# Altium project HV_DCDC.PrjPcb
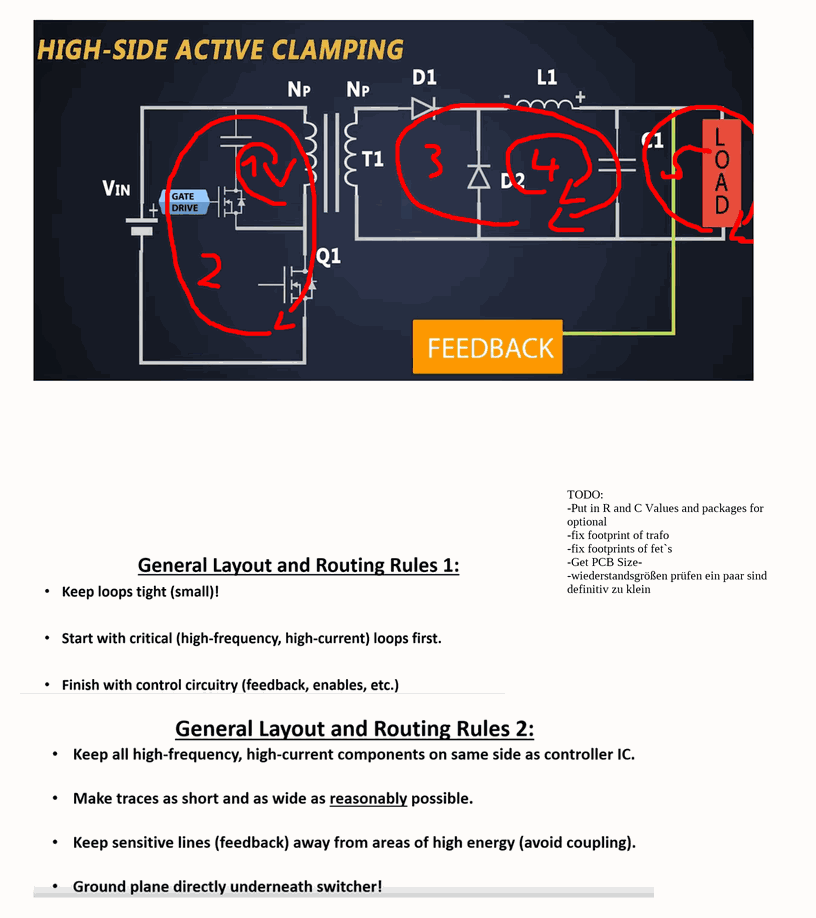
[diagram p0: Info.SchDoc]
7 sheets, 114 parts. Net scope: global (net labels, ports and power ports of the same name join across sheets).
Board files: HV_DCDC_V2.PcbDoc, HV_DCDC.PcbDoc
Sheets:
  Info.SchDoc
  In.SchDoc
  Prim_CTRL.SchDoc
  Sek_CTRL.SchDoc
  V_AUX.SchDoc
  Trafo.SchDoc
  Out.SchDoc

## Sheet Info.SchDoc
size A4; SheetNumber: 1; SheetTotal: 8

### Notes on the sheet
- TODO:
  -Put in R and C Values and packages for optional
  -fix footprint of trafo
  -fix footprints of fet`s
  -Get PCB Size-
  -wiederstandsgrößen prüfen ein paar sind definitiv zu klein

## Sheet In.SchDoc
size A4; SheetNumber: 2; SheetTotal: 8
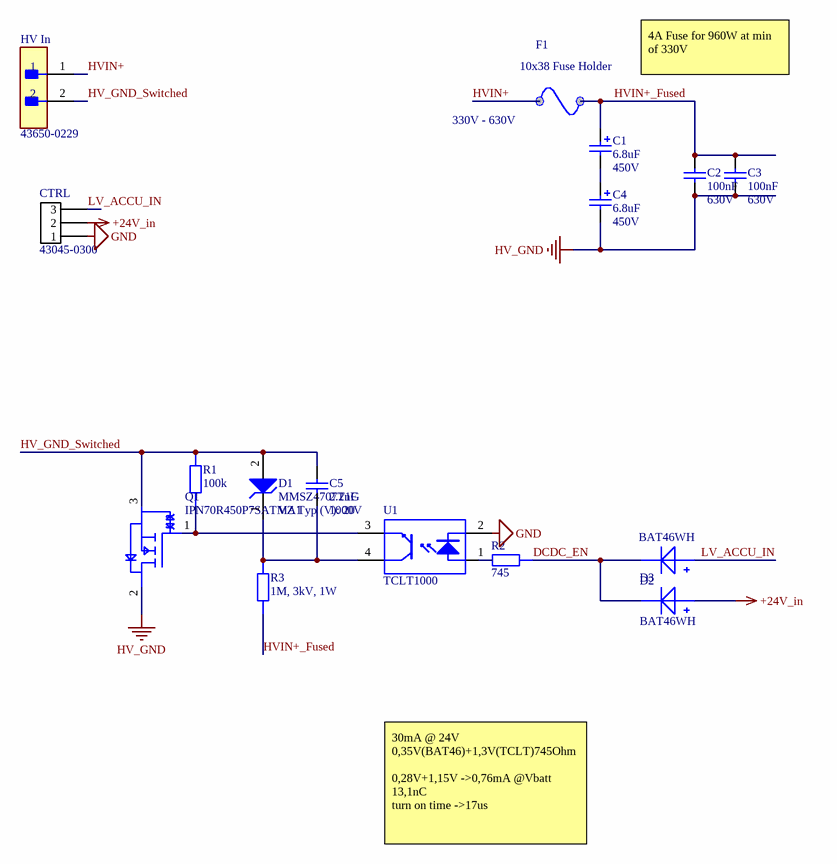
[diagram p1: In.SchDoc]

### Parts
C1  6.8uF  Voltage: 450V  [WCAP-AT1H_D13H20]
C2  Capacitance: 100nF  Voltage: 630V  [WCAP-CSMH_1812_H2]
C3  Capacitance: 100nF  Voltage: 630V  [WCAP-CSMH_1812_H2]
C4  6.8uF  Voltage: 450V  [WCAP-AT1H_D13H20]
C5  Capacitance: 2.2nF  Voltage: 1000V  [WCAP-CSMH_0805_H1.25]
CTRL  43045-0300  [43650-0315]
D1  MMSZ4707T1G  VZ Typ (V): 20  [ONSC-SOD-123-2-425-04_V]
D2  BAT46WH  [DIOM2715X18N]
D3  BAT46WH  [DIOM2715X18N]
F1  10x38 Fuse Holder  [10x38 Fuse]
HV_In  43650-0229  [FP-43650-0229-MFG]
Q1  IPN70R450P7SATMA1  [SOT230P700X180-4L]
R1  value 100k  [STACKPOLE CSR0603]  (hidden comment: SMD Resistor)
R2  value 745  [STACKPOLE CSR0603]  (hidden comment: SMD Resistor)
R3  value 1M, 3kV, 1W  [STACKPOLE CSRN2512]  (hidden comment: CHV2512-FX-1004ELF)
U1  TCLT1000  [VISH-SOP4L-4_V]

### Nets
+24V_in: CTRL.2 D3.1
GND: CTRL.1 U1.2(C)
HV_GND: C2.2 C3.2 C4.2(N) Q1.2
DCDC_EN: D2.2 D3.2 R2.2
HV_GND_Switched: C5.2 D1.2(A) HV_In.2 Q1.3 R1.1
HVIN+: F1.2 HV_In.1
HVIN+_Fused: C1.1(P) C2.1 C3.1 F1.1 R3.2
LV_ACCU_IN: CTRL.3 D2.1
NetC1_2: C1.2(N) C4.1(P)
NetC5_1: C5.1 D1.1(K) R3.1 U1.4(C)
NetQ1_1: Q1.1 R1.2 U1.3(E)
NetR2_1: R2.1 U1.1(A)

### Notes on the sheet
- (near F1) 330V - 630V
- 4A Fuse for 960W at min of 330V
- 30mA @ 24V
  0,35V(BAT46)+1,3V(TCLT)745Ohm
  0,28V+1,15V ->0,76mA @Vbatt
  13,1nC
  turn on time ->17us
- Title:
- Projekt:
- Revision:
- Author:
- Rules:
- Checked by:
- Sheet
- of
- Size:
- A4
- Date:
- Time:

### Library data of the parts
C1 C4 = 860241478002: WCAP-AT1H Aluminum Electrolytic Capacitor, Radial, THT, D13xH20mm, 6.8uF, 450V; Manufacturer: Wurth Elektronik; Rated Voltage: 450VDC; Technical Reference: ATJI2006R8M450DSPACK000; Ripple Current: 240mA; Capacitance Tolerance: +/-20%; Leakage Current: 222.4uA; Endurance: 10000h; Dissipation Factor: 20%; Published Date: October 2020; Operating Temperature: -25 to +105degC; Capacitance: 6.8uF; Packaging: Ammo Pack; Mounting Technology: THT; Manufacturer Part Number: 860241478002; Height: 20mm; Diameter: 13mm; ComponentLink2URL: https://www.we-online.com/catalog/datasheet/860241478002.pdf; ComponentLink2Description: Datasheet; ComponentLink1URL: http://www.we-online.de; ComponentLink1Description: Manufacturer
C2 C3 = 885342211006: WCAP-CSMH Multilayer Ceramic Chip Capacitor, size 1812, X7R Class II, 100nF, 630V; Manufacturer: Wurth Elektronik; Rated Voltage: 630VDC; Insulation Resistance: 1GOhm; Dissipation Factor: 2.5%; Capacitance Tolerance: +/-10%; Technical Reference: X7R1812104K630DFCT10000; ComponentLink1Description: Manufacturer; ComponentLink1URL: http://www.we-online.de; ComponentLink2Description: Datasheet; ComponentLink2URL: https://www.we-online.com/catalog/datasheet/885342211006.pdf; Manufacturer Part Number: 885342211006; Mounting Technology: SMT; Operating Temperature: -55 to +125degC; Published Date: May 2020; Packaging: Tape and Reel; Ceramic Type: X7R Class II; Height: 2mm; Size: 1812
C5 = 885342207016: WCAP-CSMH Multilayer Ceramic Chip Capacitor, size 0805, X7R Class II, 2.2nF, 1000V; Manufacturer: Wurth Elektronik; Rated Voltage: 1000VDC; Insulation Resistance: 10GOhm; Dissipation Factor: 2.5%; Capacitance Tolerance: +/-10%; Technical Reference: X7R0805222KA00DFCT10000; ComponentLink1Description: Manufacturer; ComponentLink1URL: http://www.we-online.de; ComponentLink2Description: Datasheet; ComponentLink2URL: https://www.we-online.com/catalog/datasheet/885342207016.pdf; Manufacturer Part Number: 885342207016; Mounting Technology: SMT; Operating Temperature: -55 to +125degC; Published Date: May 2020; Packaging: Tape and Reel; Ceramic Type: X7R Class II; Height: 1.25mm; Size: 0805
CTRL = MicroFit3.0 3-Pin: Molex Micro-Fit 3.0 3-Pin / 600V / 8.5A
D1 = CMP-1060-00328-1: Zener Voltage Regulator, 500 mW, 2-Pin SOD-123, Pb-Free, Tape and Reel; Manufacturer: On Semiconductor; P Max (W): 0.5; ComponentLink2Description: Datasheet; ComponentLink1Description: Manufacturer URL; PackageReference: SOD-123-2-425-04; PackageVersion: Rev. G, 10/2009; DatasheetVersion: Rev. 9; ComponentLink3URL: http://www.onsemi.com/pub_link/Collateral/425-04.PDF; ComponentLink2URL: http://www.onsemi.com/pub_link/Collateral/MMSZ4678T1-D.PDF; PackageDescription: 2-Pin SOD, Body 1.6 x 2.69 mm; Mounting Technology: Surface Mount; Packing: Tape and Reel; ComponentLink1URL: http://www.onsemi.com/; PartNumber: MMSZ4707T1G; ComponentLink3Description: Package Specification; RoHS: Pb-Free
HV_In = CMP-04776-000041-1: CONN HEADER VERT 2POS 3MM; Manufacturer: Molex; Voltage Rating: 600V; Conn Orientation: Vertical; Conn Gender: Male; Number Of Contacts: 2; Current Rating: 8.5A; ComponentLink2URL: https://www.molex.com/webdocs/datasheets/pdf/en-us/0436500229_PCB_HEADERS.pdf; ComponentLink2Description: Datasheet; Mouser Description: Headers & Wire Housings MicroFit 3.0 SR V TH Peg 30Au 2Ckt; Category: Conn; Height: 10.15mm; Contact Material: Gold,Nickel; Octopart: https://octopart.com/43650-0229-molex-7652326; Manufacturer Part Number: 43650-0229; Device Class L3: unset; Digikey Description: CONN HEADER VERT 2POS 3MM; Temperature Range Low: -40°C; Temperature Range High: +105°C; Pitch: 3mm; Package: 0; RoHS: TRUE; Device Class L1: Connectors; Lead Free: Yes; Temperature: -40°C to +105°C; Number Of Rows: 1; Automotive: No; Device Class L2: Headers and Wire Housings; Footprint Url: https://www.molex.com/pdm_docs/sd/436500229_sd.pdf
Q1 = IPN70R450P7SATMA1: IPN70R450P7S Series 700 V 10 A 7.1 W CoolMOS P7 Power Transistor - PG-SOT-223; Manufacturer: Infineon; Max Dual Supply Voltage: 700V; Supplier 1: Digi-Key; Manufacturer Part Number: IPN70R450P7SATMA1; RoHS: Yes; Category: Power Management ICs; Stock 1: 595; Pricing 1: 1=1,00000, 10=0,89700, 100=0,69970, 500=0,57798, 1000=0,50700 (USD); Mount: Surface Mount; Case/Package: SOT-223; Min Operating Temperature: -40°C; Max Operating Temperature: 150°C; Drain to Source Voltage (Vdss): 700V; Lead Free: Contains Lead; Halogen Free: Halogen Free; RoHS Compliant: Yes; ComponentLink1URL: https://www.infineon.com/dgdl/Infineon-IPN70R450P7S-DS-v02_00-EN.pdf?fileId=5546d4625f2e26bc015f526728366b78&src-supplier=Digi-Key; ComponentLink1Description: https://www.infineon.com/dgdl/Infineon-IPN70R450P7S-DS-v02_00-EN.pdf?fileId=5546d4625f2e26bc015f526728366b78&src-supplier=Digi-Key
R1-R3 = SMD Resistor: Resistor with multiple footprints
U1 = CMP-2000-07234-1: Optocoupler, Phototransistor Output, VCEO 70 V, -55 to 100 degC, 4-Pin SOP (SOP4L), RoHS, Tape and Reel; Manufacturer: Vishay/Semiconductor; Maximum Collector Emitter Voltage: 70V; Input Type: DC; Maximum Reverse Voltage: 6V; Maximum Collector Emitter Saturation Voltage: 300mV; Number of Channels per Chip: 1; Maximum Collector Current: 50mA; Maximum Power Dissipation: 250mW; Maximum Forward Voltage: 1.6V; Maximum Input Current: 60mA; Typical Forward Voltage: 1.25V; Minimum Isolation Voltage: 5000Vrms; Maximum Current Transfer Ratio @ Current: 600%; Manufacturer URL: http://www.vishay.com/; Package: 4SOP; Mounting Technology: SurfaceMount; Category: TransistorandPhotovoltaicOutputPhotoCouplers; Datasheet URL: http://www.vishay.com/docs/83515/tclt1000.pdf; Output Type: DC; Operating Temperature: -40to100°C; Package Description: 4-Pin Small Outline Package Integrated Circuit, Body 4.1 x 7.5 mm, Pitch 2.54 mm; Datasheet Version: Rev. 2.9, 12/2015; Package Reference: SOP4L; Packaging: Tape&Reel
D2 D3 = BAT46WH: Supplier 1: Mouser

## Sheet Prim_CTRL.SchDoc: Sheetname
size A4; Date: 05.10.2017; CheckedBy: UNCHECKED; Author: Team Member; Organization: Baltic Racing; Address1: Zur Schwedenschanze 15; Address2: Haus 18; Address3: 18435 Stralsund; Revision: xx.xx; SheetNumber: 3; SheetTotal: 8; Rules: TODO; ProjectName: Projekt
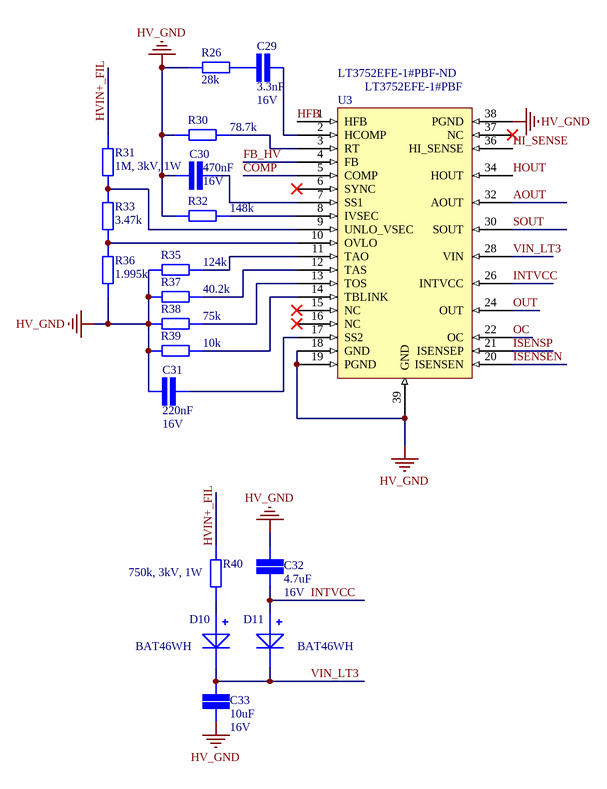
[diagram p2: Prim_CTRL.SchDoc]

### Parts
C29  value 3.3nF  Voltage: 16V  [CAP 0603/1608]  (hidden comment: SMD Capacitor)
C30  value 470nF  Voltage: 16V  [CAP 0603/1608]  (hidden comment: SMD Capacitor)
C31  value 220nF  Voltage: 16V  [CAP 0603/1608]  (hidden comment: SMD Capacitor)
C32  value 4.7uF  Voltage: 16V  [CAP 1206/3216]  (hidden comment: SMD Capacitor)
C33  value 10uF  Voltage: 16V  [CAP 1206/3216]  (hidden comment: SMD Capacitor)
D10  BAT46WH  [DIOM2715X18N]
D11  BAT46WH  [DIOM2715X18N]
R26  value 28k  [STACKPOLE CSR0603]  (hidden comment: SMD Resistor)
R30  value 78.7k  [STACKPOLE CSR0603]  (hidden comment: SMD Resistor)
R31  value 1M, 3kV, 1W  [STACKPOLE CSRN2512]  (hidden comment: CHV2512-FX-1004ELF)
R32  value 148k  [STACKPOLE CSR0603]  (hidden comment: SMD Resistor)
R33  value 3.47k  [STACKPOLE CSR0603]  (hidden comment: SMD Resistor)
R35  value 124k  [STACKPOLE CSR0603]  (hidden comment: SMD Resistor)
R36  value 1.995k  [STACKPOLE CSR0603]  (hidden comment: SMD Resistor)
R37  value 40.2k  [STACKPOLE CSR0603]  (hidden comment: SMD Resistor)
R38  value 75k  [STACKPOLE CSR0603]  (hidden comment: SMD Resistor)
R39  value 10k  [STACKPOLE CSR0603]  (hidden comment: SMD Resistor)
R40  value 750k, 3kV, 1W  [STACKPOLE CSRN2512]  (hidden comment: RCV2512750KFKEGAT)
U3  LT3752EFE-1#PBF  Supplier Part Number 1: LT3752EFE-1#PBF-ND  [TSSOP127P600-8N]

### Nets
HV_GND: C30.2 C31.2 C32.1 C33.1 R26.1 R30.2 R32.2 R35.2 R36.2 R37.2 R38.2 R39.2 U3.18(GND) U3.19(PGND) U3.20(ISENSEN) U3.38(PGND) U3.39(GND)  [also labelled ISENSEN]
AOUT: U3.32(AOUT)
COMP: U3.5(COMP)
FB_HV: U3.4(FB)
HFB: U3.1(HFB)
HI_SENSE: U3.36(HI_SENSE)
HOUT: U3.34(HOUT)
HVIN+_FIL: R31.1 R40.2
INTVCC: C32.2 D11.1 U3.26(INTVCC)
ISENSP: U3.21(ISENSEP)
OC: U3.22(OC)
OUT: U3.24(OUT)
SOUT: U3.30(SOUT)
VIN_LT3: C33.2 D10.2 D11.2 U3.28(VIN)
NetC29_1: C29.1 R26.2
NetC29_2: C29.2 U3.2(HCOMP)
NetC30_1: C30.1 U3.7(SS1)
NetC31_1: C31.1 U3.17(SS2)
NetD10_1: D10.1 R40.1
NetR30_1: R30.1 U3.3(RT)
NetR31_2: R31.2 R33.1 U3.9(UNLO_VSEC)
NetR32_1: R32.1 U3.8(IVSEC)
NetR33_2: R33.2 R36.1 U3.10(OVLO)
NetR35_1: R35.1 U3.11(TAO)
NetR37_1: R37.1 U3.12(TAS)
NetR38_1: R38.1 U3.13(TOS)
NetR39_1: R39.1 U3.14(TBLINK)

Not connected (* = marked no-connect by the designer): U3 6(SYNC)* 15(NC)* 16(NC)* 37(NC)*

### Notes on the sheet
- Title:
- Projekt:
- Revision:
- Author:
- Rules:
- Checked by:
- Sheet
- of
- Size:
- A4
- Date:
- Time:

### Library data of the parts
C29-C33 = SMD Capacitor: Capacitor with multiple Footprints
R26 R30-R33 R35-R40 = SMD Resistor: Resistor with multiple footprints
U3 = LT3752EFE-1#PBF: Current Mode PWM Controller 100kHz to 500kHz Automotive 31-Pin TSSOP EP Tube; Manufacturer: Analog Devices / Linear Technology; Min Supply Voltage: 10.5V; Max Supply Voltage: 16V; Number of Outputs: 1; Max Duty Cycle: 95%; Synchronous Rectifier: Yes; Topology: Forward Converter; Supplier 1: Digi-Key; Manufacturer Part Number: LT3752EFE-1#PBF; RoHS: Yes; Category: Voltage Regulators - Switching; Stock 1: 108; Pricing 1: 1=8,12000, 10=7,33800, 25=6,99720, 100=6,07550, 250=5,80244, 500=5,31300 (USD); Case/Package: TSSOP; Number of Pins: 38; Min Operating Temperature: -40°C; Max Operating Temperature: 125°C; Frequency: 500kHz; Packaging: Rail/Tube; Number of Output Phases: 1; Switching Frequency: 500kHz; Clock Sync: Yes; REACH SVHC: No SVHC; RoHS Compliant: Yes; ComponentLink1URL: https://datasheet.ciiva.com/46429/1841069-46429096.pdf?src-supplier=Element14; ComponentLink1Description: https://datasheet.ciiva.com/46429/1841069-46429096.pdf?src-supplier=Element14
D10 D11 = BAT46WH: Supplier 1: Mouser

## Sheet Sek_CTRL.SchDoc: Sheetname
size A4; Date: 05.10.2017; CheckedBy: UNCHECKED; Author: Team Member; Organization: Baltic Racing; Address1: Zur Schwedenschanze 15; Address2: Haus 18; Address3: 18435 Stralsund; Revision: xx.xx; SheetNumber: 4; SheetTotal: 8; Rules: TODO; ProjectName: Projekt
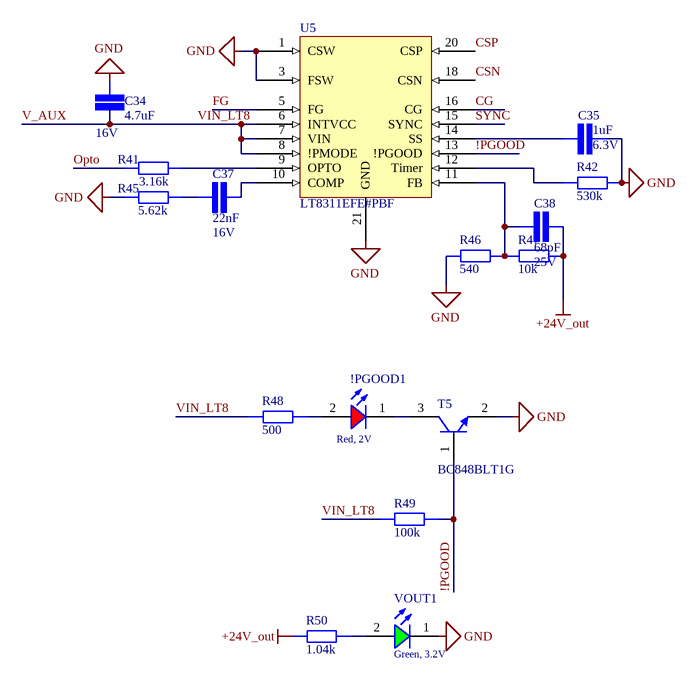
[diagram p3: Sek_CTRL.SchDoc]

### Parts
!PGOOD1  Red, 2V  [WL-SMCW_0603_H=0.7mm]
C34  value 4.7uF  Voltage: 16V  [CAP 0603/1608]  (hidden comment: SMD Capacitor)
C35  value 1uF  Voltage: 6.3V  [CAP 0603/1608]  (hidden comment: SMD Capacitor)
C37  value 22nF  Voltage: 16V  [CAP 0603/1608]  (hidden comment: SMD Capacitor)
C38  value 68pF  Voltage: 25V  [CAP 0603/1608]  (hidden comment: SMD Capacitor)
R41  value 3.16k  [STACKPOLE CSR0603]  (hidden comment: SMD Resistor)
R42  value 530k  [STACKPOLE CSR0603]  (hidden comment: SMD Resistor)
R45  value 5.62k  [STACKPOLE CSR0603]  (hidden comment: SMD Resistor)
R46  value 540  [STACKPOLE CSR0603]  (hidden comment: SMD Resistor)
R47  value 10k  [STACKPOLE CSR0603]  (hidden comment: SMD Resistor)
R48  value 500  [STACKPOLE CSR0603]  (hidden comment: SMD Resistor)
R49  value 100k  [STACKPOLE CSR0603]  (hidden comment: SMD Resistor)
R50  value 1.04k  [STACKPOLE CSR0603]  (hidden comment: SMD Resistor)
T5  BC848BLT1G  [ONSC-SOT-23-3-318-08_V]
U5  LT8311EFE#PBF  [TSSOP 20 Lead LT8311]
VOUT1  Green, 3.2V  [WL-SMCW_0603_H=0.7mm]

### Nets
+24V_out: C38.2 R47.1 R50.1
GND: C34.2 C35.2 R42.2 R45.2 R46.2 T5.2(E) U5.1(CSW) U5.3(FSW) U5.21(GND) VOUT1.1(K)
!PGOOD: R49.1 T5.1(B) U5.13(!PGOOD)
CG: U5.16(CG)
CSN: U5.18(CSN)
CSP: U5.20(CSP)
FG: U5.5(FG)
Opto: R41.1
SYNC: U5.15(SYNC)
V_AUX: C34.1 R48.2 R49.2 U5.6(INTVCC) U5.7(VIN) U5.8(!PMODE)  [also labelled VIN_LT8]
Net!PGOOD1_1: !PGOOD1.1(K) T5.3(C)
Net!PGOOD1_2: !PGOOD1.2(A) R48.1
NetC35_1: C35.1 U5.14(SS)
NetC37_1: C37.1 R45.1
NetC37_2: C37.2 U5.10(COMP)
NetC38_1: C38.1 R46.1 R47.2 U5.11(FB)
NetR41_2: R41.2 U5.9(OPTO)
NetR42_1: R42.1 U5.12(Timer)
NetR50_2: R50.2 VOUT1.2(A)

### Notes on the sheet
- Title:
- Projekt:
- Revision:
- Author:
- Rules:
- Checked by:
- Sheet
- of
- Size:
- A4
- Date:
- Time:

### Library data of the parts
!PGOOD1 = 150060RS75000: WL-SMCW SMT Mono-color Chip LED Waterclear, size 0603, Red, 2V, 140deg; Chip Technology: AlInGaP; Dominant Wavelength typ.: 625nm; Luminous Intensity typ.: 250mcd; Peak Wavelength typ.: 630nm; Viewing Angle: 140deg; ComponentLink1Description: Manufacturer; ComponentLink1URL: http://www.we-online.de; ComponentLink2URL: https://www.we-online.com/catalog/datasheet/150060RS75000.pdf; ComponentLink2Description: Datasheet; Forward Voltage typ.: 2V; Emitting Color: Red; Mounting Technology: SMT; Operating Temperature: -40 to +85degC; Published Date: December 2019; Part Number: 150060RS75000; Packaging: Tape and Reel; Size: 0603; Publisher: Wurth Elektronik
C34 C35 C37 C38 = SMD Capacitor: Capacitor with multiple Footprints
R41 R42 R45-R50 = SMD Resistor: Resistor with multiple footprints
T5 = CMP-1048-00679-1: General Purpose Transistor, NPN Silicon, 3-Pin SOT-23, Pb-Free, Tape and Reel; Manufacturer: On Semiconductor; fT Min (MHz): 100; IC Continuous (A): 0.1; DatasheetVersion: Rev. 11; PackageVersion: Rev. AP, 11/2009; RoHS: TRUE; PartNumber: BC848BLT1G; ComponentLink1Description: Manufacturer URL; PackageReference: SOT-23-3-318-08; ComponentLink3Description: Package Specification; ComponentLink1URL: http://www.onsemi.com/; Polarity: NPN; ComponentLink2Description: Datasheet; ComponentLink2URL: http://www.onsemi.cn/pub_link/Collateral/BC846ALT1-D.PDF; ComponentLink3URL: http://www.onsemi.cn/pub_link/Collateral/318-08.PDF; PackageDescription: 3-Pin Small Outline Transistor, Body 2.92 x 1.3 mm, Pitch 0.95 mm; Packing: Tape and Reel; Mounting Technology: Surface Mount
U5 = LT8311EFE#PBF: LT8311 - Synchronous Rectifier Controller with Opto-Coupler Driver for Forward Converters; Manufacturer: Analog Devices / Linear Technology; Operating Supply Current: 4.5mA; Min Supply Voltage: 3.7V; Max Supply Voltage: 30V; Supplier 1: Digi-Key; Manufacturer Part Number: LT8311EFE#PBF; RoHS: Yes; Category: Gate Drivers; Pricing 1: 1=7,34000, 10=6,63200, 25=6,32360, 100=5,49060, 250=5,24384, 500=4,80150 (USD); Mount: Surface Mount; Case/Package: TSSOP; Number of Pins: 20; Min Operating Temperature: -40°C; Max Operating Temperature: 150°C; Packaging: Rail/Tube; Package Quantity: 74; RoHS Compliant: Yes; REACH SVHC: No SVHC; ComponentLink1URL: https://datasheet.ciiva.com/46423/1810721-46423691.pdf?src-supplier=Element14; ComponentLink1Description: https://datasheet.ciiva.com/46423/1810721-46423691.pdf?src-supplier=Element14; ComponentLink2URL: https://datasheet.ciiva.com/29699/44625-29699311.pdf?src-supplier=Digi-Key; ComponentLink2Description: https://datasheet.ciiva.com/29699/44625-29699311.pdf?src-supplier=Digi-Key
VOUT1 = 150060GS75000: WL-SMCW SMT Mono-color Chip LED Waterclear, size 0603, Green, 3.2V, 140deg; Chip Technology: InGaN; Dominant Wavelength typ.: 525nm; Luminous Intensity typ.: 430mcd; Peak Wavelength typ.: 515nm; Viewing Angle: 140deg; ComponentLink1Description: Manufacturer; ComponentLink1URL: http://www.we-online.de; ComponentLink2URL: https://www.we-online.com/catalog/datasheet/150060GS75000.pdf; ComponentLink2Description: Datasheet; Forward Voltage typ.: 3.2V; Emitting Color: Green; Mounting Technology: SMT; Operating Temperature: -40 to +85degC; Published Date: December 2019; Part Number: 150060GS75000; Packaging: Tape and Reel; Size: 0603; Publisher: Wurth Elektronik

## Sheet V_AUX.SchDoc
size A4; SheetNumber: 6; SheetTotal: 8
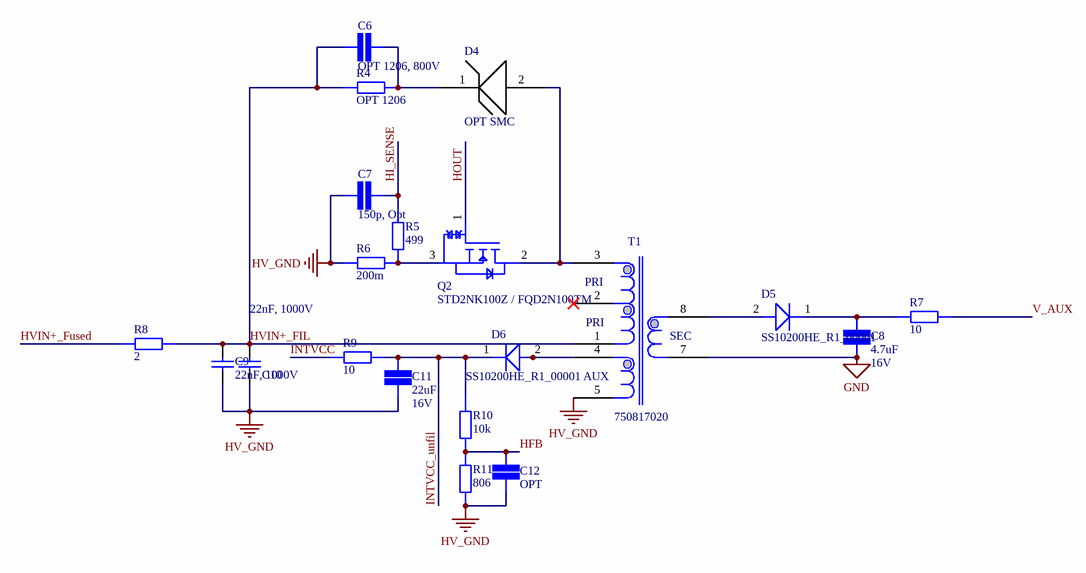
[diagram p4: V_AUX.SchDoc]

### Parts
C6  value OPT 1206, 800V  [CAP 1206/3216]  (hidden comment: SMD Capacitor)
C7  value 150p, Opt  [CAP 0603/1608]  (hidden comment: SMD Capacitor)
C8  value 4.7uF  Voltage: 16V  [CAP 0603/1608]  (hidden comment: SMD Capacitor)
C9  22nF, 1000V  [WCAP-CSMH_1210_H1.6]
C10  22nF, 1000V  [WCAP-CSMH_1210_H1.6]
C11  value 22uF  Voltage: 16V  [CAP 0603/1608]  (hidden comment: SMD Capacitor)
C12  value OPT  [CAP 0603/1608]  (hidden comment: SMD Capacitor)
D4  OPT SMC  [JEDEC DO-214AB]
D5  SS10200HE_R1_00001  [Chip2PinSM127P600-8N]
D6  SS10200HE_R1_00001  [Chip2PinSM127P600-8N]
Q2  STD2NK100Z / FQD2N100TM  [DPAK TO-252]
R4  value OPT 1206  [STACKPOLE CSR1206]  (hidden comment: SMD Resistor)
R5  value 499  [STACKPOLE CSR0603]  (hidden comment: SMD Resistor)
R6  value 200m  [STACKPOLE CSR0603]  (hidden comment: KDV12FR200ET)
R7  value 10  [STACKPOLE CSR0603]  (hidden comment: SMD Resistor)
R8  value 2  [STACKPOLE CSR0603]  (hidden comment: SMD Resistor)
R9  value 10  [STACKPOLE CSR0603]  (hidden comment: SMD Resistor)
R10  value 10k  [STACKPOLE CSR0603]  (hidden comment: SMD Resistor)
R11  value 806  [STACKPOLE CSR0603]  (hidden comment: SMD Resistor)
T1  750817020  [750817020 Transformer]

### Nets
GND: C8.1 T1.7
HV_GND: C7.1 C9.1 C10.1 C11.1 C12.2 R6.2 R11.2 T1.5
HFB: C12.1 R10.2 R11.1
HI_SENSE: C7.2 R5.1
HOUT: Q2.1
HVIN+_FIL: C6.1 C9.2 C10.2 R4.1 R8.1 T1.1
HVIN+_Fused: R8.2
INTVCC: R9.2
INTVCC_unfil: C11.2 D6.1 R9.1 R10.1
V_AUX: R7.1
NetC6_2: C6.2 D4.1 R4.2
NetC8_2: C8.2 D5.1 R7.2
NetD4_2: D4.2 Q2.2 T1.3
NetD5_2: D5.2 T1.8
NetD6_2: D6.2 T1.4
NetQ2_3: Q2.3 R5.2 R6.1

Not connected (* = marked no-connect by the designer): T1 2*

### Notes on the sheet
- Title:
- Projekt:
- Revision:
- Author:
- Rules:
- Checked by:
- Sheet
- of
- Size:
- A4
- Date:
- Time:
- (in symbol 750817020) PRI; SEC; AUX

### Library data of the parts
C6-C8 C11 C12 = SMD Capacitor: Capacitor with multiple Footprints
C9 C10 = 885342209007: WCAP-CSMH Multilayer Ceramic Chip Capacitor, size 1210, X7R Class II, 22nF, 1000V; Manufacturer: Wurth Elektronik; Rated Voltage: 1000VDC; Insulation Resistance: 4.55GOhm; Dissipation Factor: 2.5%; Capacitance Tolerance: +/-10%; Technical Reference: X7R1210223KA00DFCT10000; ComponentLink1Description: Manufacturer; ComponentLink1URL: http://www.we-online.de; ComponentLink2Description: Datasheet; ComponentLink2URL: https://www.we-online.com/catalog/datasheet/885342209007.pdf; Manufacturer Part Number: 885342209007; Mounting Technology: SMT; Operating Temperature: -55 to +125degC; Published Date: May 2020; Packaging: Tape and Reel; Ceramic Type: X7R Class II; Capacitance: 22nF; Height: 1.6mm; Size: 1210
D4 = SMC30J24A: Manufacturer: STMicroelectronics; Direction: Unidirectional; Number of Unidirectional Channels: 1; Reverse Standoff Voltage: 24V; Min Breakdown Voltage: 26.7V; Clamping Voltage: 38.9V; Peak Pulse Power: 3kW; Power Line Protection: No; Peak Pulse Current: 77A; Diode Type: ZENER; Supplier 1: Newark; Manufacturer Part Number: SMC30J24A; RoHS: Yes; Category: Diodes; Pricing 1: 2500=0,61100 (USD); Mount: Surface Mount; Case/Package: SMC; Number of Pins: 2; Min Operating Temperature: -55°C; Max Operating Temperature: 175°C; Packaging: Tape and Reel; Package Quantity: 2500; Polarity: Unidirectional; Working Voltage: 24V; Max Power Dissipation: 3kW; Breakdown Voltage: 26.7V; Resistor Type: Zener; Series: SMC30J, TRANSIL™; Radiation Hardening: No; REACH SVHC: No SVHC; Lead Free: Lead Free; RoHS Compliant: Yes; ComponentLink1URL: https://datasheet.ciiva.com/339/dm00035134-339433.pdf?src-supplier=Digi-Key; ComponentLink1Description: https://datasheet.ciiva.com/339/dm00035134-339433.pdf?src-supplier=Digi-Key; ComponentLink2URL: https://datasheet.ciiva.com/339/dm00035134-339434.pdf?src-supplier=Digi-Key; ComponentLink2Description: https://datasheet.ciiva.com/339/dm00035134-339434.pdf?src-supplier=Digi-Key; ComponentLink3URL: https://datasheet.ciiva.com/339/dm00035134-339435.pdf?src-supplier=Digi-Key; ComponentLink3Description: https://datasheet.ciiva.com/339/dm00035134-339435.pdf?src-supplier=Digi-Key; Supplier Part Number 1: 87T3691
D5 D6 = SS10200HE_R1_00001: Schottky 1A 200V SOD-123HE; Manufacturer: Pan Jit; Supplier 1: DigiKey; Manufacturer Part Number: SS10200HE_R1_00001; RoHS: Yes; Stock 1: 9000; Pricing 1: 1=0,40000, 10=0,30100, 100=0,17040, 500=0,11286, 1000=0,08653 (USD)
Q2 = STD2NK100Z: N-channel 1000 V, 6.25 Ohm typ., 1.85 A, Zener-protected SuperMESH Power MOSFET in DPAK package; Manufacturer: STMicroelectronics; Continuous Drain Current (ID): 1.85A; Gate to Source Voltage (Vgs): 30V; Rds On Max: 8.5R; Input Capacitance: 499pF; Max Power Dissipation: 70W; Number of Elements: 1; Drain to Source Voltage (Vdss): 1kV; Threshold Voltage: 3.75V; Turn-On Delay Time: 7.2ns; Turn-Off Delay Time: 41.5ns; Element Configuration: Single; Supplier 1: Digi-Key; Manufacturer Part Number: STD2NK100Z; RoHS: Yes; Category: MOSFETs; Stock 1: 2365; Pricing 1: 1=2,45000, 10=2,19600, 100=1,76550, 500=1,45048, 1000=1,31862 (USD); Mount: Surface Mount; Case/Package: DPAK; Number of Pins: 3; Contact Plating: Tin,Matte; Min Operating Temperature: -55°C; Max Operating Temperature: 150°C; Packaging: Tape and Reel; Package Quantity: 2500; Drain to Source Breakdown Voltage: 1kV; Drain to Source Resistance: 8.5R; Power Dissipation: 70W; On-State Resistance: 8.5R; Polarity: N-CHANNEL; Series: SuperMESH™; Drain-source On Resistance-Max: 8.5R; Length: 6.6mm; Width: 6.2mm; Height: 2.4mm; Radiation Hardening: No; REACH SVHC: No SVHC; Lead Free: Lead Free; RoHS Compliant: Yes; ComponentLink1URL: https://datasheet.ciiva.com/8025/1561863-8025045.pdf?src-supplier=Element14; ComponentLink1Description: https://datasheet.ciiva.com/8025/1561863-8025045.pdf?src-supplier=Element14; ComponentLink2URL: https://datasheet.ciiva.com/25625/0900766b810e895b-25625259.pdf?src-supplier=RSComponents; ComponentLink2Description: https://datasheet.ciiva.com/25625/0900766b810e895b-25625259.pdf?src-supplier=RSComponents; ComponentLink3URL: https://datasheet.ciiva.com/938/cd00159991-938647.pdf?src-supplier=Digi-Key; ComponentLink3Description: https://datasheet.ciiva.com/938/cd00159991-938647.pdf?src-supplier=Digi-Key; ComponentLink4URL: https://datasheet.ciiva.com/6380/cd00159991-6380217.pdf?src-supplier=Digi-Key; ComponentLink4Description: https://datasheet.ciiva.com/6380/cd00159991-6380217.pdf?src-supplier=Digi-Key; ComponentLink5URL: https://datasheet.ciiva.com/16220/cd00159991-16220233.pdf?src-supplier=Future+Electronics; ComponentLink5Description: https://datasheet.ciiva.com/16220/cd00159991-16220233.pdf?src-supplier=Future+Electronics; ComponentLink6URL: https://datasheet.ciiva.com/6380/cd00159991-6380219.pdf?src-supplier=Digi-Key; ComponentLink6Description: https://datasheet.ciiva.com/6380/cd00159991-6380219.pdf?src-supplier=Digi-Key
R4-R11 = SMD Resistor: Resistor with multiple footprints
T1 = 750817020: WE Transformer

## Sheet Trafo.SchDoc: Sheetname
size A4; Date: 05.10.2017; CheckedBy: UNCHECKED; Author: Team Member; Organization: Baltic Racing; Address1: Zur Schwedenschanze 15; Address2: Haus 18; Address3: 18435 Stralsund; Revision: xx.xx; SheetNumber: 7; SheetTotal: 8; Rules: TODO; ProjectName: Projekt
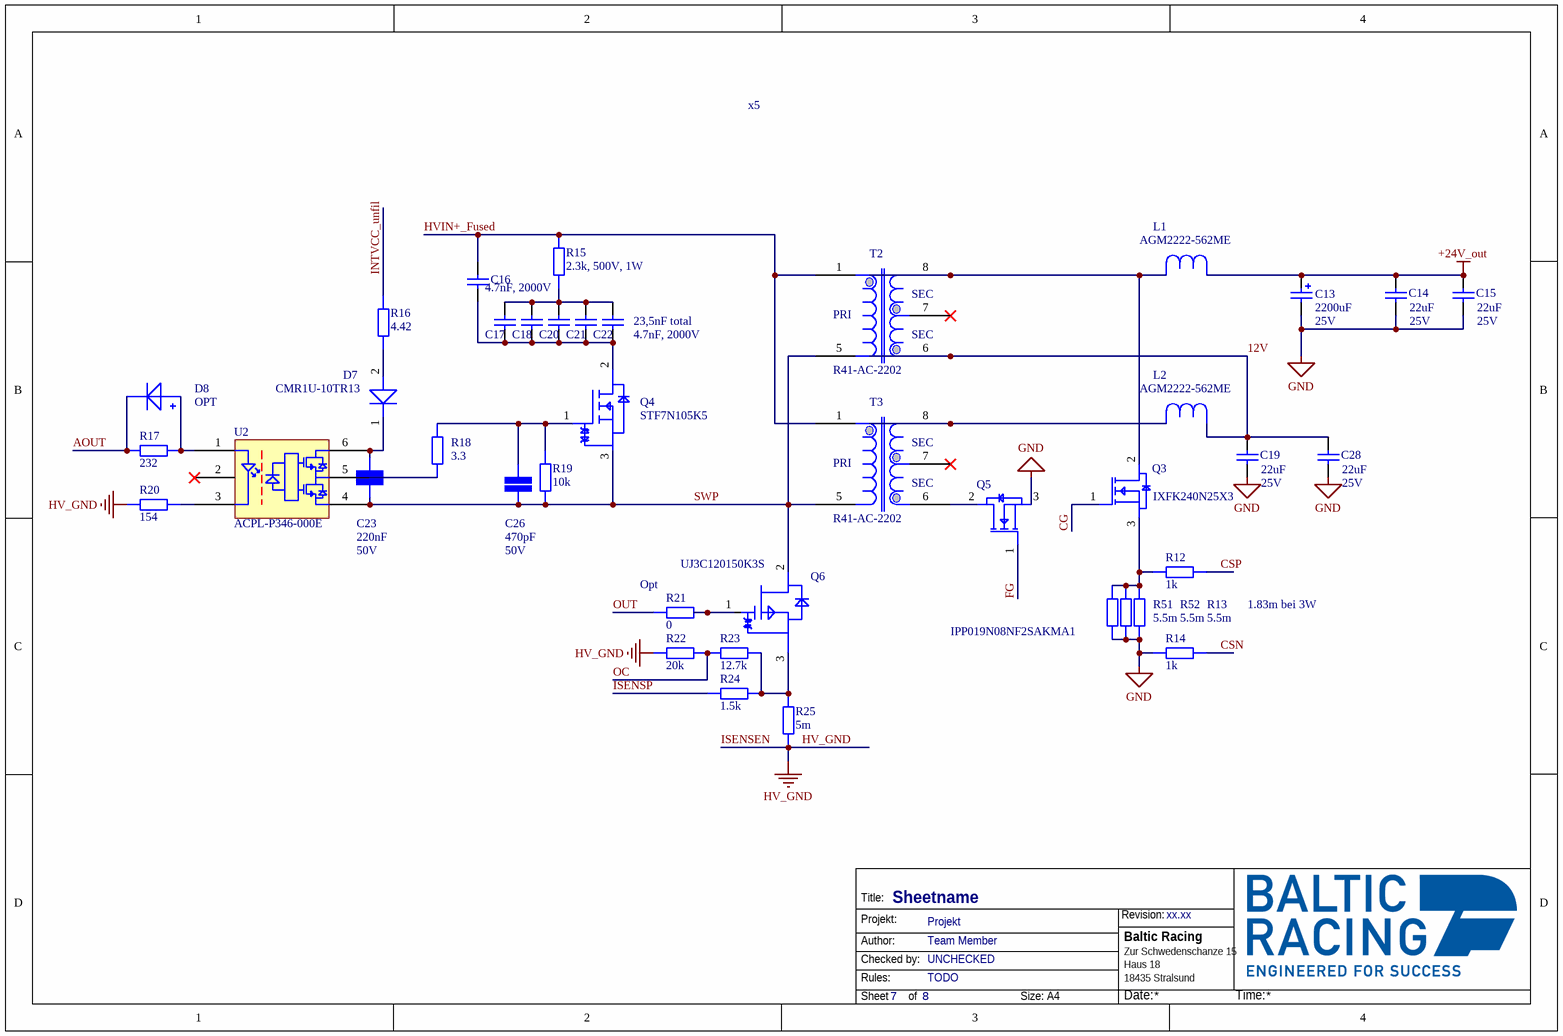
[diagram p5: Trafo.SchDoc]

### Parts
C13  Capacitance: 2200uF  Voltage: 25V  [WCAP-ATG8_D13H25]
C14  Capacitance: 22uF  Voltage: 25V  [WCAP-CSGP_1210_H=2.5mm]
C15  Capacitance: 22uF  Voltage: 25V  [WCAP-CSGP_1210_H=2.5mm]
C16  4.7nF, 2000V  [WCAP-CSMH_1812_H2]
C17  4.7nF, 2000V  [WCAP-CSMH_1812_H2]  (value not drawn)
C18  4.7nF, 2000V  [WCAP-CSMH_1812_H2]  (value not drawn)
C19  Capacitance: 22uF  Voltage: 25V  [WCAP-CSGP_1210_H=2.5mm]
C20  4.7nF, 2000V  [WCAP-CSMH_1812_H2]  (value not drawn)
C21  4.7nF, 2000V  [WCAP-CSMH_1812_H2]  (value not drawn)
C22  4.7nF, 2000V  [WCAP-CSMH_1812_H2]
C23  value 220nF  Voltage: 50V  [CAP 1206/3216]  (hidden comment: SMD Capacitor)
C26  value 470pF  Voltage: 50V  [CAP 1206/3216]  (hidden comment: SMD Capacitor)
C28  Capacitance: 22uF  Voltage: 25V  [WCAP-CSGP_1210_H=2.5mm]
D7  CMR1U-10TR13  [DIOC4536X24L CMR1U-10]
D8  OPT  [DIOM2715X18N]
L1  AGM2222-562ME  [AGM2222-562]
L2  AGM2222-562ME  [AGM2222-562]
Q3  IXFK240N25X3  [IXFK240N25X3_w_Cooler]
Q4  STF7N105K5  [TO-220-3]
Q5  IPP019N08NF2SAKMA1  [IPP019N08NF2SAKMA1_w_Cooler]
Q6  UJ3C120150K3S  [UJ3C120150K3S_w_Cooler]
R12  value 1k  [STACKPOLE CSR1206]  (hidden comment: SMD Resistor)
R13  value 5.5m  [STACKPOLE CSR1206]
R14  value 1k  [STACKPOLE CSR1206]  (hidden comment: SMD Resistor)
R15  value 2.3k, 500V, 1W  [STACKPOLE CSRN2512]  (hidden comment: CRCW25122K20FKEG)
R16  value 4.42  [STACKPOLE CSR0603]  (hidden comment: SMD Resistor)
R17  value 232  [STACKPOLE CSR1206]  (hidden comment: SMD Resistor)
R18  value 3.3  [STACKPOLE CSR0603]  (hidden comment: SMD Resistor)
R19  value 10k  [STACKPOLE CSR0603]  (hidden comment: SMD Resistor)
R20  value 154  [STACKPOLE CSR1206]  (hidden comment: SMD Resistor)
R21  value 0  [STACKPOLE CSR0603]  (hidden comment: SMD Resistor)
R22  value 20k  [STACKPOLE CSR0603]  (hidden comment: SMD Resistor)
R23  value 12.7k  [STACKPOLE CSR0603]  (hidden comment: SMD Resistor)
R24  value 1.5k  [STACKPOLE CSR0603]  (hidden comment: SMD Resistor)
R25  value 5m  [STACKPOLE CSR1206]  (hidden comment: ULR1S-R0055FT2)
R51  value 5.5m  [STACKPOLE CSR1206]
R52  value 5.5m  [STACKPOLE CSR1206]
T2  R41-AC-2202  [R41-AC-2202 Landing Pattern]
T3  R41-AC-2202  [R41-AC-2202 Landing Pattern]
U2  ACPL-P346-000E  [SOP-6 Stretched]

### Nets
+24V_out: C13.1(P) C14.1 C15.1 L1.2
GND: C13.2(N) C14.2 C15.2 C19.2 C28.2 Q5.3 R13.1 R14.1 R51.1 R52.1
HV_GND: R20.1 R22.1 R25.2  [also labelled ISENSEN]
12V: C19.1 C28.1 L2.2 T2.6
AOUT: D8.2 R17.1
CG: Q3.1
CSN: R14.2
CSP: R12.2
FG: Q5.1
HVIN+_Fused: C16.1 R15.2 T2.1 T3.1
INTVCC_unfil: R16.2
ISENSP: R24.1
OC: R22.2 R23.1
OUT: R21.1
SWP: C23.2 C26.2 Q4.3 Q6.2 R19.1 T2.5 T3.5 U2.4
NetC16_2: C16.2 C17.2 C18.2 C20.2 C21.2 C22.2 Q4.2
NetC17_1: C17.1 C18.1 C20.1 C21.1 C22.1 R15.1
NetC23_1: C23.1 D7.1 U2.6
NetC26_1: C26.1 Q4.1 R18.2 R19.2
NetD7_2: D7.2 R16.1
NetD8_1: D8.1 R17.2 U2.1
NetL1_1: L1.1 Q3.2 T2.8
NetL2_1: L2.1 T3.8
NetQ3_3: Q3.3 R12.1 R13.2 R51.2 R52.2
NetQ5_2: Q5.2 T3.6
NetQ6_1: Q6.1 R21.2
NetQ6_3: Q6.3 R23.2 R24.2 R25.1
NetR18_1: R18.1 U2.5
NetR20_2: R20.2 U2.3

Not connected (* = marked no-connect by the designer): T2 7*; T3 7*; U2 2*

### Notes on the sheet
- x5
- (near C22) 23,5nF total
- (near R21) Opt
- 1.83m bei 3W
- Title:
- Projekt:
- Revision:
- Author:
- Rules:
- Checked by:
- Sheet
- of
- Size:
- A4
- Date:
- Time:
- (in symbol R41-AC-2202) SEC; PRI

### Library data of the parts
C13 = 860010478021: WCAP-ATG8 Aluminum Electrolytic Capacitor, Radial, THT, D13xH25, 2200uF, 25V; Manufacturer: Wurth Elektronik; Ripple Current: 1705mA; Rated Voltage: 25VDC; Technical Reference: ATBI250222M025DSPACB000; Leakage Current: 550uA; Endurance: 2000h; Dissipation Factor: 14%; Capacitance Tolerance: +/-20%; ComponentLink2Description: Datasheet; Published Date: October 2020; Packaging: Ammo Pack; Operating Temperature: -40 to +85degC; Mounting Technology: THT; Manufacturer Part Number: 860010478021; Height: 25mm; Diameter: 13mm; ComponentLink2URL: https://www.we-online.com/catalog/datasheet/860010478021.pdf; ComponentLink1URL: http://www.we-online.de; ComponentLink1Description: Manufacturer
C14 C15 C19 C28 = 885012109014: WCAP-CSGP Multilayer Ceramic Chip Capacitor, General Purpose, size 1210, X5R, 22uF, 25V; Manufacturer: Wurth Elektronik; Rated Voltage: 25VDC; Isolation Resistance  min.: 0.005GOhm; Capacitance Tolerance: +/-20%; Dissipation Factor max.: 5%; Technical Reference: X5R1210226M025DFCT10000; ComponentLink1Description: Manufacturer; ComponentLink1URL: http://www.we-online.de; ComponentLink2Description: Datasheet; ComponentLink2URL: https://www.we-online.com/catalog/datasheet/885012109014.pdf; Operating Temperature: -55 to +85degC; Packaging: Tape and Reel; Manufacturer Part Number: 885012109014; Published Date: April 2021; Ceramic Type: X5R; Height: 2.5mm; Mounting Technology: SMT; Size: 1210; Q-Factor min.: -
C16-C18 C20-C22 = 885342211008: WCAP-CSMH Multilayer Ceramic Chip Capacitor, size 1812, X7R Class II, 4.7nF, 2000V; Manufacturer: Wurth Elektronik; Rated Voltage: 2000VDC; Insulation Resistance: 10GOhm; Dissipation Factor: 2.5%; Capacitance Tolerance: +/-10%; Technical Reference: X7R1812472KB00DFCT10000; ComponentLink1Description: Manufacturer; ComponentLink1URL: http://www.we-online.de; ComponentLink2Description: Datasheet; ComponentLink2URL: https://www.we-online.com/catalog/datasheet/885342211008.pdf; Manufacturer Part Number: 885342211008; Mounting Technology: SMT; Operating Temperature: -55 to +125degC; Published Date: May 2020; Packaging: Tape and Reel; Ceramic Type: X7R Class II; Capacitance: 4.7nF; Height: 2mm; Size: 1812
  C16 C17: Voltage: 2000V
C23 C26 = SMD Capacitor: Capacitor with multiple Footprints
D7 = CMR1U-10TR13: Silicon Ultra Fast Recovery Rectifier 1000V 30A 2-Pin SMB Surface Mount T/R; Manufacturer: Central Semiconductor; Average Rectified Current: 1A; Reverse Recovery Time: 100ns; Max Reverse Voltage (DC): 1kV; Forward Voltage: 1.7V; Max Reverse Current: 5uA; Supplier 1: Digi-Key; Manufacturer Part Number: CMR1U-10TR13; RoHS: No; Category: Rectifier Diodes; Pricing 1: 1=1,16000, 10=1,03800, 100=0,80960, 500=0,66880, 1000=0,52800 (USD); Mount: Surface Mount; Case/Package: SMB; Packaging: Tape and Reel; Max Repetitive Reverse Voltage (Vrrm): 1kV; RoHS Compliant: No; Lead Free: Lead Free; ComponentLink1URL: http://www.mouser.com/ds/2/68/cmr1u-01-34700.pdf?src-supplier=Mouser; ComponentLink1Description: http://www.mouser.com/ds/2/68/cmr1u-01-34700.pdf?src-supplier=Mouser; ComponentLink2URL: https://www.centralsemi.com/get_document.php?cmp=1&mergetype=pd&mergepath=pd&pdf_id=CMR1U-01.PDF&src-supplier=Digi-Key; ComponentLink2Description: https://www.centralsemi.com/get_document.php?cmp=1&mergetype=pd&mergepath=pd&pdf_id=CMR1U-01.PDF&src-supplier=Digi-Key; ComponentLink3URL: http://www.centralsemi.com/pdf/CMR1U-01.PDF?src-supplier=Future+Electronics; ComponentLink3Description: http://www.centralsemi.com/pdf/CMR1U-01.PDF?src-supplier=Future+Electronics; ComponentLink4URL: https://my.centralsemi.com/get_document.php?cmp=1&amp;mergetype=pd&amp;mergepath=pd&amp;pdf_id=CMR1U-01.PDF&src-supplier=Digi-Key; ComponentLink4Description: https://my.centralsemi.com/get_document.php?cmp=1&amp;mergetype=pd&amp;mergepath=pd&amp;pdf_id=CMR1U-01.PDF&src-supplier=Digi-Key
D8 = BAT46WH: Supplier 1: Mouser
L1 L2 = AGM2222-562ME: Shielded Power Inductors; ComponentLink1Description: Coilcraft; ComponentLink1URL: https://www.coilcraft.com/en-us/products/power/shielded-inductors/high-current-flat-wire/agp-ver/agm2222/?skuId=30439; ComponentLink2Description: Datasheet; ComponentLink2URL: https://www.coilcraft.com/getmedia/d4f4984d-2507-4e11-ae3d-89829a15fb28/agm2222.pdf
Q3 = IXFK240N25X3: Mosfet N-ch 250V 240A TO264; Manufacturer: IXYS; Supplier 1: Mouser; Manufacturer Part Number: IXFK240N25X3; RoHS: No; Stock 1: 7; Pricing 1: 1=30,00000, 10=27,67000, 50=25,40000, 100=24,04000, 1000=24,04000, 10000=24,04000 (USD)
Q4 = STF7N105K5: N-channel 1050 V, 1.4 Ohm typ., 4 A MDmesh K5 Power MOSFETs in TO-220FP package; Manufacturer: STMicroelectronics; Drain to Source Voltage (Vdss): 1.05kV; Continuous Drain Current (ID): 4A; Rds On Max: 2R; Input Capacitance: 380pF; Max Power Dissipation: 25W; Supplier 1: Newark; Manufacturer Part Number: STF7N105K5; RoHS: Yes; Category: MOSFETs; Stock 1: 996; Pricing 1: 1=3,16000, 10=2,71000, 100=2,16000, 500=1,87000, 1000=1,61000 (USD); Mount: Through Hole; Case/Package: TO-220-3; Min Operating Temperature: -55°C; Max Operating Temperature: 150°C; Packaging: Rail/Tube; Lead Free: Lead Free; RoHS Compliant: Yes; ComponentLink1URL: http://www.mouser.com/ds/2/389/stf7n105k5-955843.pdf?src-supplier=Mouser; ComponentLink1Description: http://www.mouser.com/ds/2/389/stf7n105k5-955843.pdf?src-supplier=Mouser; ComponentLink2URL: http://www.st.com/content/ccc/resource/technical/document/datasheet/26/20/d1/f7/b4/c1/4c/55/DM00112886.pdf/files/DM00112886.pdf/jcr:content/translations/en.DM00112886.pdf?src-supplier=Digi-Key; ComponentLink2Description: http://www.st.com/content/ccc/resource/technical/document/datasheet/26/20/d1/f7/b4/c1/4c/55/DM00112886.pdf/files/DM00112886.pdf/jcr:content/translations/en.DM00112886.pdf?src-supplier=Digi-Key; ComponentLink3URL: http://www.st.com/st-web-ui/static/active/en/resource/technical/document/datasheet/DM00112886.pdf?src-supplier=Avnet; ComponentLink3Description: http://www.st.com/st-web-ui/static/active/en/resource/technical/document/datasheet/DM00112886.pdf?src-supplier=Avnet; ComponentLink4URL: http://www.farnell.com/datasheets/2371890.pdf?src-supplier=Newark; ComponentLink4Description: http://www.farnell.com/datasheets/2371890.pdf?src-supplier=Newark
Q5 = IPP019N08NF2SAKMA1: Transistor Power MOSFET N-Channel 80V 191A 3-Pin TO-220 Tube; Manufacturer: Infineon; Supplier 1: Digi-Key; Manufacturer Part Number: IPP019N08NF2SAKMA1; RoHS: No; Category: Uncategorized; Stock 1: 760; Pricing 1: 1=3,34000, 10=2,99500, 100=2,45420, 500=2,09760 (USD)
Q6 = UJ3C120150K3S: Sicfet N-ch 1200V 18.4A TO247-3; Manufacturer: UnitedSiC; Supplier 1: Mouser; Manufacturer Part Number: UJ3C120150K3S; RoHS: No; Stock 1: 697; Pricing 1: 1=9,16000, 10=8,28000, 50=7,90000, 100=7,90000, 1000=5,96000, 10000=5,15000 (USD)
R12-R25 R51 R52 = SMD Resistor: Resistor with multiple footprints
T2 T3 = R41-AC-2202: High Voltage Transformer
U2 = ACPL-P346-000E: Logic IC Output Optocoupler, 1-Element, 3750V Isolation; Manufacturer: Broadcom Avago; Propagation Delay: 120ns; Number of Channels: 1; Forward Voltage: 1.55V; Max Output Current: 2.5A; Pulse Width Distortion (PWD): 50ns; High Level Output Current: 2A; Operating Supply Voltage: 20V; Forward Current: 4mA; Max Power Dissipation: 550mW; Rise Time: 8ns; Isolation Voltage: 3.75kV; Output Current: 1A; Input Current: 11mA; Max Input Current: 25mA; Approvals: CSA,UR,UL,IEC; Supplier 1: Digi-Key; Manufacturer Part Number: ACPL-P346-000E; RoHS: Yes; Category: Optocouplers; Stock 1: 1063; Pricing 1: 1=5,00000, 10=3,53300, 100=2,89340, 500=2,43922, 1000=2,38050 (USD); Mount: Surface Mount; Case/Package: SOIC; Number of Pins: 6; Min Operating Temperature: -40°C; Max Operating Temperature: 105°C; Packaging: Rail/Tube; Package Quantity: 100; Turn-On Delay Time: 120ns; Low Level Output Current: 2A; Fall Time: 8ns; Output Voltage: 20V; Radiation Hardening: No; RoHS Compliant: Yes; REACH SVHC: No SVHC

## Sheet Out.SchDoc: Sheetname
size A4; Date: 05.10.2017; CheckedBy: UNCHECKED; Author: Team Member; Organization: Baltic Racing; Address1: Zur Schwedenschanze 15; Address2: Haus 18; Address3: 18435 Stralsund; Revision: xx.xx; SheetNumber: 8; SheetTotal: 8; Rules: TODO; ProjectName: Projekt
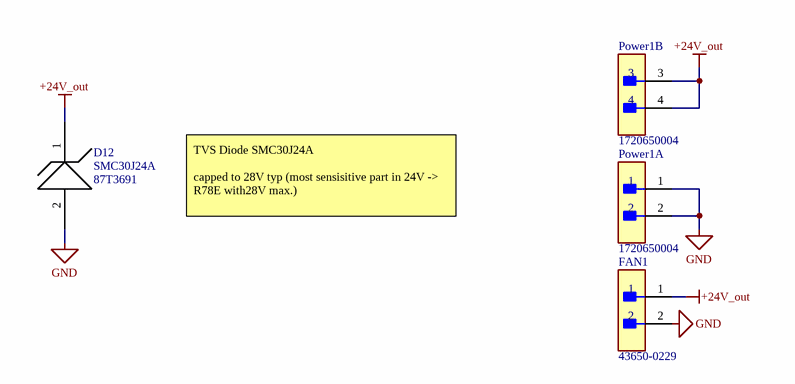
[diagram p6: Out.SchDoc]

### Parts
D12  SMC30J24A  Supplier Part Number 1: 87T3691  [JEDEC DO-214AB]
FAN1  43650-0229  [FP-43650-0229-MFG]
Power1  1720650004  [FP-1720650004-MFG]  (parts A,B of 2)

### Nets
+24V_out: D12.1 FAN1.1 Power1.3 Power1.4
GND: D12.2 FAN1.2 Power1.1 Power1.2

### Notes on the sheet
- TVS Diode SMC30J24A
  capped to 28V typ (most sensisitive part in 24V -> R78E with28V max.)
- Title:
- Projekt:
- Revision:
- Author:
- Rules:
- Checked by:
- Sheet
- of
- Size:
- A4
- Date:
- Time:

### Library data of the parts
D12 = SMC30J24A: 3000 W TVS in SMC package; Manufacturer: STMicroelectronics; Direction: Unidirectional; Number of Unidirectional Channels: 1; Reverse Standoff Voltage: 24V; Min Breakdown Voltage: 26.7V; Clamping Voltage: 38.9V; Peak Pulse Power: 3kW; Power Line Protection: No; Peak Pulse Current: 77A; Diode Type: ZENER; Supplier 1: Newark; Manufacturer Part Number: SMC30J24A; RoHS: Yes; Category: Diodes; Pricing 1: 2500=0,61100 (USD); Mount: Surface Mount; Case/Package: SMC; Number of Pins: 2; Min Operating Temperature: -55°C; Max Operating Temperature: 175°C; Packaging: Tape and Reel; Package Quantity: 2500; Polarity: Unidirectional; Working Voltage: 24V; Max Power Dissipation: 3kW; Breakdown Voltage: 26.7V; Resistor Type: Zener; Series: SMC30J, TRANSIL™; Radiation Hardening: No; REACH SVHC: No SVHC; Lead Free: Lead Free; RoHS Compliant: Yes; ComponentLink1URL: https://datasheet.ciiva.com/339/dm00035134-339433.pdf?src-supplier=Digi-Key; ComponentLink1Description: https://datasheet.ciiva.com/339/dm00035134-339433.pdf?src-supplier=Digi-Key; ComponentLink2URL: https://datasheet.ciiva.com/339/dm00035134-339434.pdf?src-supplier=Digi-Key; ComponentLink2Description: https://datasheet.ciiva.com/339/dm00035134-339434.pdf?src-supplier=Digi-Key; ComponentLink3URL: https://datasheet.ciiva.com/339/dm00035134-339435.pdf?src-supplier=Digi-Key; ComponentLink3Description: https://datasheet.ciiva.com/339/dm00035134-339435.pdf?src-supplier=Digi-Key
FAN1 = CMP-04776-000041-1: as HV_In on sheet In; ComponentLink2URL: https://www.molex.com/webdocs/datasheets/pdf/en-us/0436500229_PCB_HEADERS.pdf; ComponentLink2Description: Datasheet; Mouser Description: Headers & Wire Housings MicroFit 3.0 SR V TH Peg 30Au 2Ckt; Category: Conn; Height: 10.15mm; Contact Material: Gold,Nickel; Octopart: https://octopart.com/43650-0229-molex-7652326; Manufacturer Part Number: 43650-0229; Device Class L3: unset; Digikey Description: CONN HEADER VERT 2POS 3MM; Temperature Range Low: -40°C; Temperature Range High: +105°C; Pitch: 3mm; Package: 0; RoHS: TRUE; Device Class L1: Connectors; Lead Free: Yes; Temperature: -40°C to +105°C; Number Of Rows: 1; Automotive: No; Device Class L2: Headers and Wire Housings; Footprint Url: https://www.molex.com/pdm_docs/sd/436500229_sd.pdf
Power1 = CMP-04776-000102-1: CONN HEADER VERT 4POS 5.7MM; Manufacturer: Molex; Conn Orientation: Vertical; Conn Gender: Male; Voltage Rating: 600V; Number Of Contacts: 4; Current Rating: 23A; Footprint Url: https://www.molex.com/pdm_docs/sd/1720650004_sd.pdf; RoHS: TRUE; Mouser Description: Headers & Wire Housings Mega-Fit Vert Hdr Assy 4 ckt 15u Au; Temperature: -40°C to +120°C; Device Class L3: unset; Temperature Range Low: -40°C; Temperature Range High: +120°C; Device Class L1: Connectors; Lead Free: Yes; Height: 15.05mm; Manufacturer Part Number: 1720650004; ComponentLink2URL: https://www.molex.com/webdocs/datasheets/pdf/en-us/1720650004_PCB_HEADERS.pdf; Number Of Rows: 2; Digikey Description: CONN HEADER VERT 4POS 5.7MM; Octopart: https://octopart.com/172065-0004-molex-34473112; Automotive: No; Category: Conn; ComponentLink2Description: Datasheet; Contact Material: Gold,Nickel; Device Class L2: Headers and Wire Housings; Pitch: 5.7mm; Package: 1720650004

## Nets that join several sheets
+24V_out: Sek_CTRL (C38.2 R47.1 R50.1), Trafo (C13.1 C14.1 C15.1 L1.2), Out (D12.1 FAN1.1 Power1.3 Power1.4)
GND: In (CTRL.1 U1.2), Sek_CTRL (10 pins), V_AUX (C8.1 T1.7), Trafo (10 pins), Out (D12.2 FAN1.2 Power1.1 Power1.2)
HV_GND: In (C2.2 C3.2 C4.2 Q1.2), Prim_CTRL (17 pins), V_AUX (8 pins), Trafo (R20.1 R22.1 R25.2)
AOUT: Prim_CTRL (U3.32), Trafo (D8.2 R17.1)
CG: Sek_CTRL (U5.16), Trafo (Q3.1)
CSN: Sek_CTRL (U5.18), Trafo (R14.2)
CSP: Sek_CTRL (U5.20), Trafo (R12.2)
FG: Sek_CTRL (U5.5), Trafo (Q5.1)
HFB: Prim_CTRL (U3.1), V_AUX (C12.1 R10.2 R11.1)
HI_SENSE: Prim_CTRL (U3.36), V_AUX (C7.2 R5.1)
HOUT: Prim_CTRL (U3.34), V_AUX (Q2.1)
HVIN+_FIL: Prim_CTRL (R31.1 R40.2), V_AUX (6 pins)
HVIN+_Fused: In (5 pins), V_AUX (R8.2), Trafo (C16.1 R15.2 T2.1 T3.1)
INTVCC: Prim_CTRL (C32.2 D11.1 U3.26), V_AUX (R9.2)
INTVCC_unfil: V_AUX (C11.2 D6.1 R9.1 R10.1), Trafo (R16.2)
ISENSP: Prim_CTRL (U3.21), Trafo (R24.1)
OC: Prim_CTRL (U3.22), Trafo (R22.2 R23.1)
OUT: Prim_CTRL (U3.24), Trafo (R21.1)
V_AUX: Sek_CTRL (6 pins), V_AUX (R7.1)